# Altium schematic sheet USB_connnection.SchDoc
size 209 x 297 mm
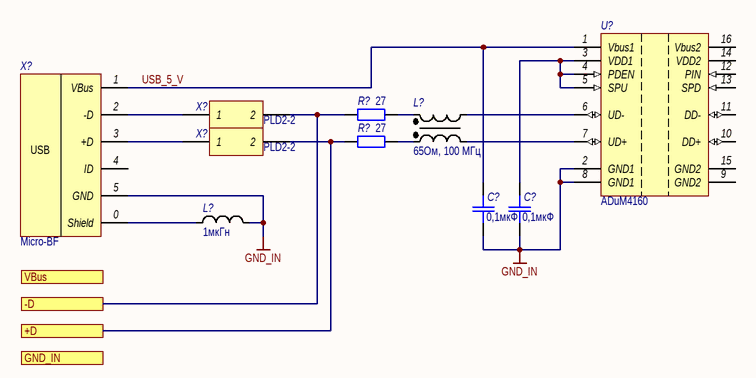
[diagram p0: USB_connnection.SchDoc]

## Parts
(Parts that share a designator on the sheet are numbered #1, #2 ... from top to bottom, then left to right.)
C?#1  0,1мкФ  [SMD_0805]
C?#2  0,1мкФ  [SMD_0805]
L?#1  65Ом, 100 МГц  [ACM2012]
L?#2  1мкГн  [SMD_0805]
R?#1  27  [SMD_0805]
R?#2  27  [SMD_0805]
U?  ADuM1402  [SOIC-16-WIDE]  (value not drawn)
X?#1  Наименование: PLD2-2  [PLD2-20]  (hidden comment: Header 2X1)
X?#2  Наименование: PLD2-2  [PLD2-20]  (hidden comment: Header 2X1)
X?#3  Наименование: Micro-BF  [USB Micro-BF]  (hidden comment: mico-BF)

## Ports
+D, -D, GND_IN, VBus

## Nets
GND_IN: C?#1.1 C?#2.1 L?#2.2 U?.2(GND1) U?.8(GND1) X?#3.5(GND)
+D: R?#2.1 X?#2.2 ; port +D
-D: R?#1.1 X?#1.2 ; port -D
USB_5_V: C?#1.2 U?.1(Vbus1) X?#3.1(VBus)
NetC?#2_2: C?#2.2 U?.3(VDD1) U?.4(PDEN) U?.5(SPU)
NetL?#1_1: L?#1.1 U?.7(UD+)
NetL?#1_2: L?#1.2 R?#2.2
NetL?#1_3: L?#1.3 R?#1.2
NetL?#1_4: L?#1.4 U?.6(UD-)
NetL?#2_1: L?#2.1 X?#3.0(Shield)
NetX?#1_1: X?#1.1 X?#3.2(-D)
NetX?#2_1: X?#2.1 X?#3.3(+D)

Not connected (* = marked no-connect by the designer): U? 9(GND2) 10(DD+) 11(DD-) 12(PIN) 13(SPD) 14(VDD2) 15(GND2) 16(Vbus2); X?#3 4(ID)

## Notes on the sheet
- Подп. и дата
- Инв. № дубл.
- Взам. инв. №
- Инв. № подл.
- Изм.
- Лист
- № докум.
- Подп.
- Дата
- Форма 2а ГОСТ 2.104-2006
- Копировал
- Формат А4
- (in symbol MicroUSB) USB

## Library data of the parts
C?#1 C?#2 = Capacitor: Назначение: SMD-конденсатор; Наименование: Конденсатор; Потребление, Вт: 0; Value: 0,1мкФ
L?#1 = Inductor_coupled: Coupled inductor; Назначение: Связанная индуктивность; Value: 20мкГн, 8,5мОм; Наименование: PLT10HH1026R0PN; Потребление, Вт: 0,1
L?#2 = Inductor: Наименование: Индуктивность; Назначение: SMD-индуктивность; Потребление, Вт: 0,010; Value: 1мкГн
R?#1 R?#2 = Resistor: Наименование: Резистор; Назначение: SMD-резистор; Потребление, Вт: 0,001; Value: 1к
U? = ADuM4160: Quad Channel Digital Isolator, 2.5 KV rms Insulation Rating; Назначение: цифровой изолятор шины USB; Потребление, Вт: 0,025; DataSheet: https://www.analog.com/media/en/technical-documentation/data-sheets/ADuM4160.pdf; Наименование: ADuM4160
X?#1 X?#2 = HDR2X1: Header, 12-Pin, Dual row; Назначение: Header, 20-Pin, Dual row; Потребление, Вт: 0,0
X?#3 = MicroUSB: USB mico-BF; Назначение: Разъем на плату; Потребление, Вт: 0; DataSheet: *